# EAGLE design Raspberry_Pi_2_Breakout (EAGLE 8.1.0)
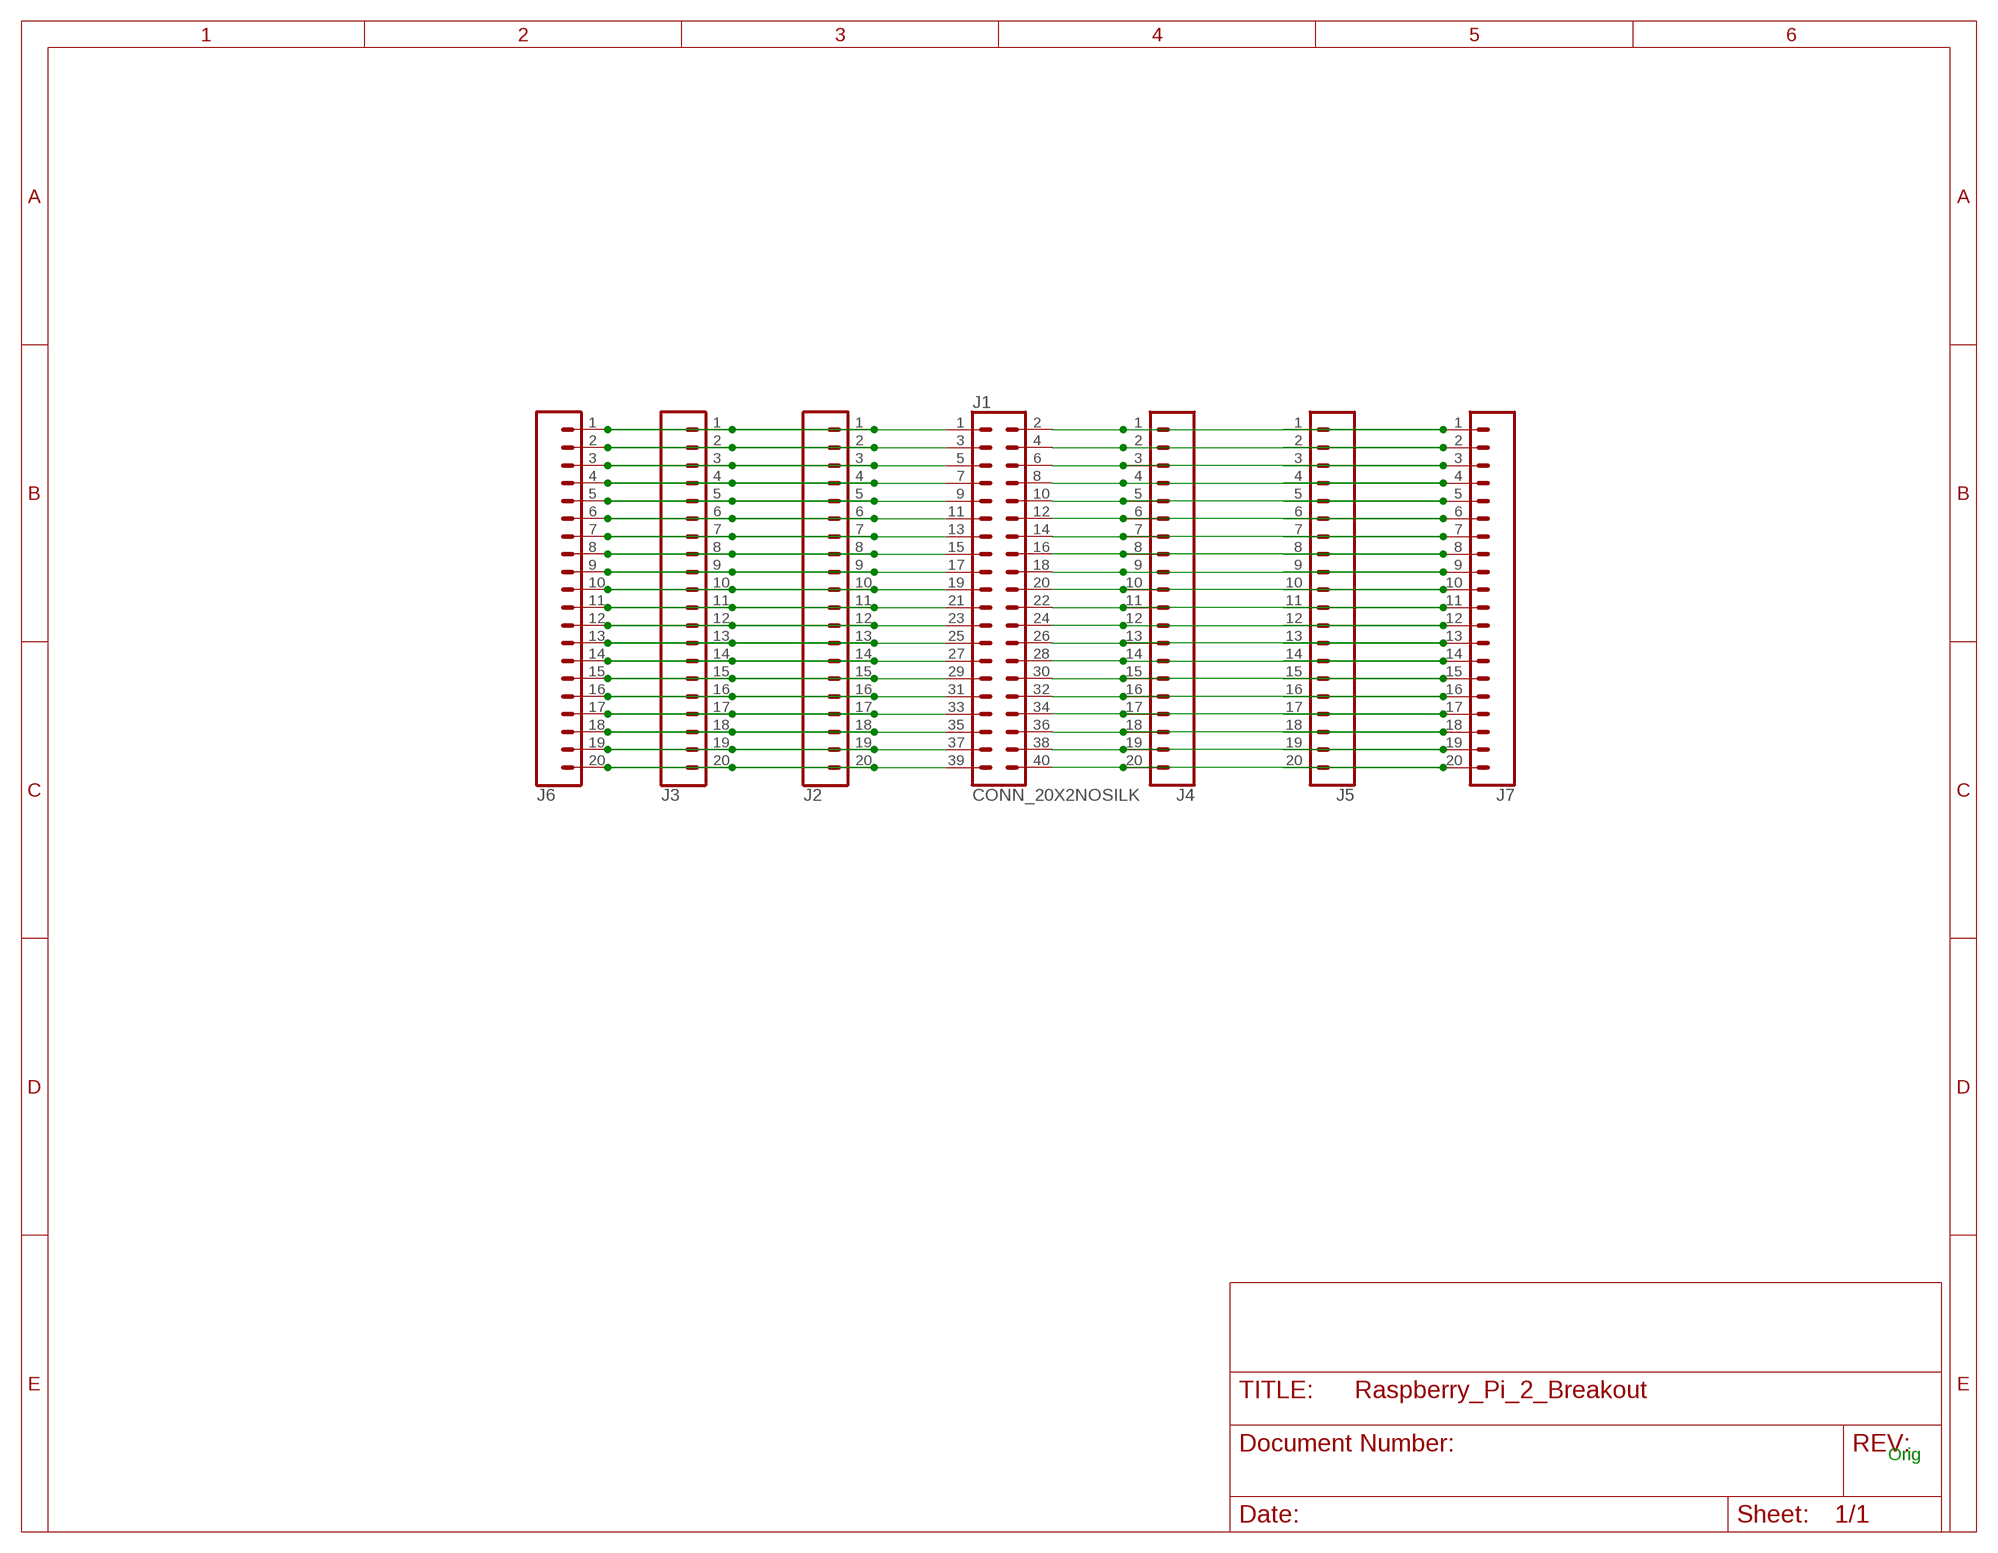
[diagram p0: schematic, sheet 1]

## Parts
J1  CONN_20X2NOSILK  [2X20_NOSILK]
J2  CONN_20NOSILK  [1X20_NOSILK]
J3  CONN_20NOSILK  [1X20_NOSILK]
J4  CONN_20NOSILK  [1X20_NOSILK]
J5  CONN_20NOSILK  [1X20_NOSILK]
J6  CONN_20NOSILK  [1X20_NOSILK]
J7  CONN_20NOSILK  [1X20_NOSILK]

## Nets
N$1: J1.1 J2.1 J3.1 J6.1
N$2: J1.2 J4.1 J5.1 J7.1
N$3: J1.4 J4.2 J5.2 J7.2
N$6: J1.6 J4.3 J5.3 J7.3
N$7: J1.8 J4.4 J5.4 J7.4
N$8: J1.10 J4.5 J5.5 J7.5
N$9: J1.12 J4.6 J5.6 J7.6
N$10: J1.14 J4.7 J5.7 J7.7
N$11: J1.16 J4.8 J5.8 J7.8
N$12: J1.18 J4.9 J5.9 J7.9
N$13: J1.20 J4.10 J5.10 J7.10
N$14: J1.22 J4.11 J5.11 J7.11
N$15: J1.24 J4.12 J5.12 J7.12
N$16: J1.26 J4.13 J5.13 J7.13
N$17: J1.28 J4.14 J5.14 J7.14
N$18: J1.30 J4.15 J5.15 J7.15
N$19: J1.32 J4.16 J5.16 J7.16
N$20: J1.34 J4.17 J5.17 J7.17
N$21: J1.36 J4.18 J5.18 J7.18
N$22: J1.38 J4.19 J5.19 J7.19
N$23: J1.40 J4.20 J5.20 J7.20
N$26: J1.39 J2.20 J3.20 J6.20
N$27: J1.37 J2.19 J3.19 J6.19
N$28: J1.35 J2.18 J3.18 J6.18
N$29: J1.33 J2.17 J3.17 J6.17
N$30: J1.31 J2.16 J3.16 J6.16
N$31: J1.29 J2.15 J3.15 J6.15
N$32: J1.27 J2.14 J3.14 J6.14
N$33: J1.25 J2.13 J3.13 J6.13
N$34: J1.23 J2.12 J3.12 J6.12
N$35: J1.21 J2.11 J3.11 J6.11
N$36: J1.19 J2.10 J3.10 J6.10
N$37: J1.17 J2.9 J3.9 J6.9
N$38: J1.15 J2.8 J3.8 J6.8
N$39: J1.13 J2.7 J3.7 J6.7
N$40: J1.11 J2.6 J3.6 J6.6
N$41: J1.9 J2.5 J3.5 J6.5
N$42: J1.7 J2.4 J3.4 J6.4
N$43: J1.5 J2.3 J3.3 J6.3
N$44: J1.3 J2.2 J3.2 J6.2

## Notes on the sheet
- Orig

## Library data of the parts
J1 = SparkFun-Connectors:CONN_20X2: Multi connection point. Often used as Generic Header-pin footprint for 0.1 inch spaced/style header connections On any of the 0.1 inch spaced packages, you can populate with these: Break Away Headers - Straight <https://www.sparkfun.com/products/116> (PRT-00116) Break Away Male Headers - Right Angle <https://www.sparkfun.com/products/553> (PRT-00553) Female Headers <https://www.sparkfun.com/products/115> (PRT-00115) Break Away Headers - Machine Pin <https://www.sparkfun.com/products/117> (PRT-00117) Break Away Female Headers - Swiss Machine Pin <https://www.sparkfun.com/products/743> (PRT-00743)
J2-J7 = SparkFun-Connectors:CONN_20: Multi connection point. Often used as Generic Header-pin footprint for 0.1 inch spaced/style header connections On any of the 0.1 inch spaced packages, you can populate with these: Break Away Headers - Straight <https://www.sparkfun.com/products/116> (PRT-00116) Break Away Male Headers - Right Angle <https://www.sparkfun.com/products/553> (PRT-00553) Female Headers <https://www.sparkfun.com/products/115> (PRT-00115) Break Away Headers - Machine Pin <https://www.sparkfun.com/products/117> (PRT-00117) Break Away Female Headers - Swiss Machine Pin <https://www.sparkfun.com/products/743> (PRT-00743) For SCREWTERMINALS and SPRING TERMINALS visit here: Screw Terimnals on SparkFun.com <https://www.sparkfun.com/search/results?term=Screw+Terminals> (5mm/3.5mm/2.54mm spacing) This device is also useful as a general connection point to wire up your design to another part of your project. Our various solder wires solder well into these plated through hole pads. Hook-Up Wire - Assortment (Stranded, 22 AWG) <https://www.sparkfun.com/products/11375> (PRT-11375) Hook-Up Wire - Assortment (Solid Core, 22 AWG) <https://www.sparkfun.com/products/11367> (PRT-11367) View the entire wire category on our website here <https://www.sparkfun.com/categories/141> Special notes: Molex polarized connector foot print use with SKU : PRT-08231 with associated crimp pins and housings. 1MM SMD Version SKU: PRT-10208 NOTES ON THE VARIANTS LOCK and LOCK_LONGPADS... This footprint was designed to help hold the alignment of a through-hole component (i.e. 6-pin header) while soldering it into place. You may notice that each hole has been shifted either up or down by 0.005 of an inch from it's more standard position (which is a perfectly straight line). This slight alteration caused the pins (the squares in the middle) to touch the edges of the holes. Because they are alternating, it causes a "brace" to hold the component in place. 0.005 has proven to be the perfect amount of "off-center" position when using our standard breakaway headers. Although looks a little odd when you look at the bare footprint, once you have a header in there, the alteration is very hard to notice. Also,if you push a header all the way into place, it is covered up entirely on the bottom side. Note about LOCK SPECIAL package: This is just like the LOCK variant in that the holes are staggared by 5 mil, but except for the last two holes. They are not altered from the "standard" footprint layout. This is used for a special purpose on the layout of our Graphic LCD Backpack. Make sure you want to use this device before selecting it for you project!

## Board
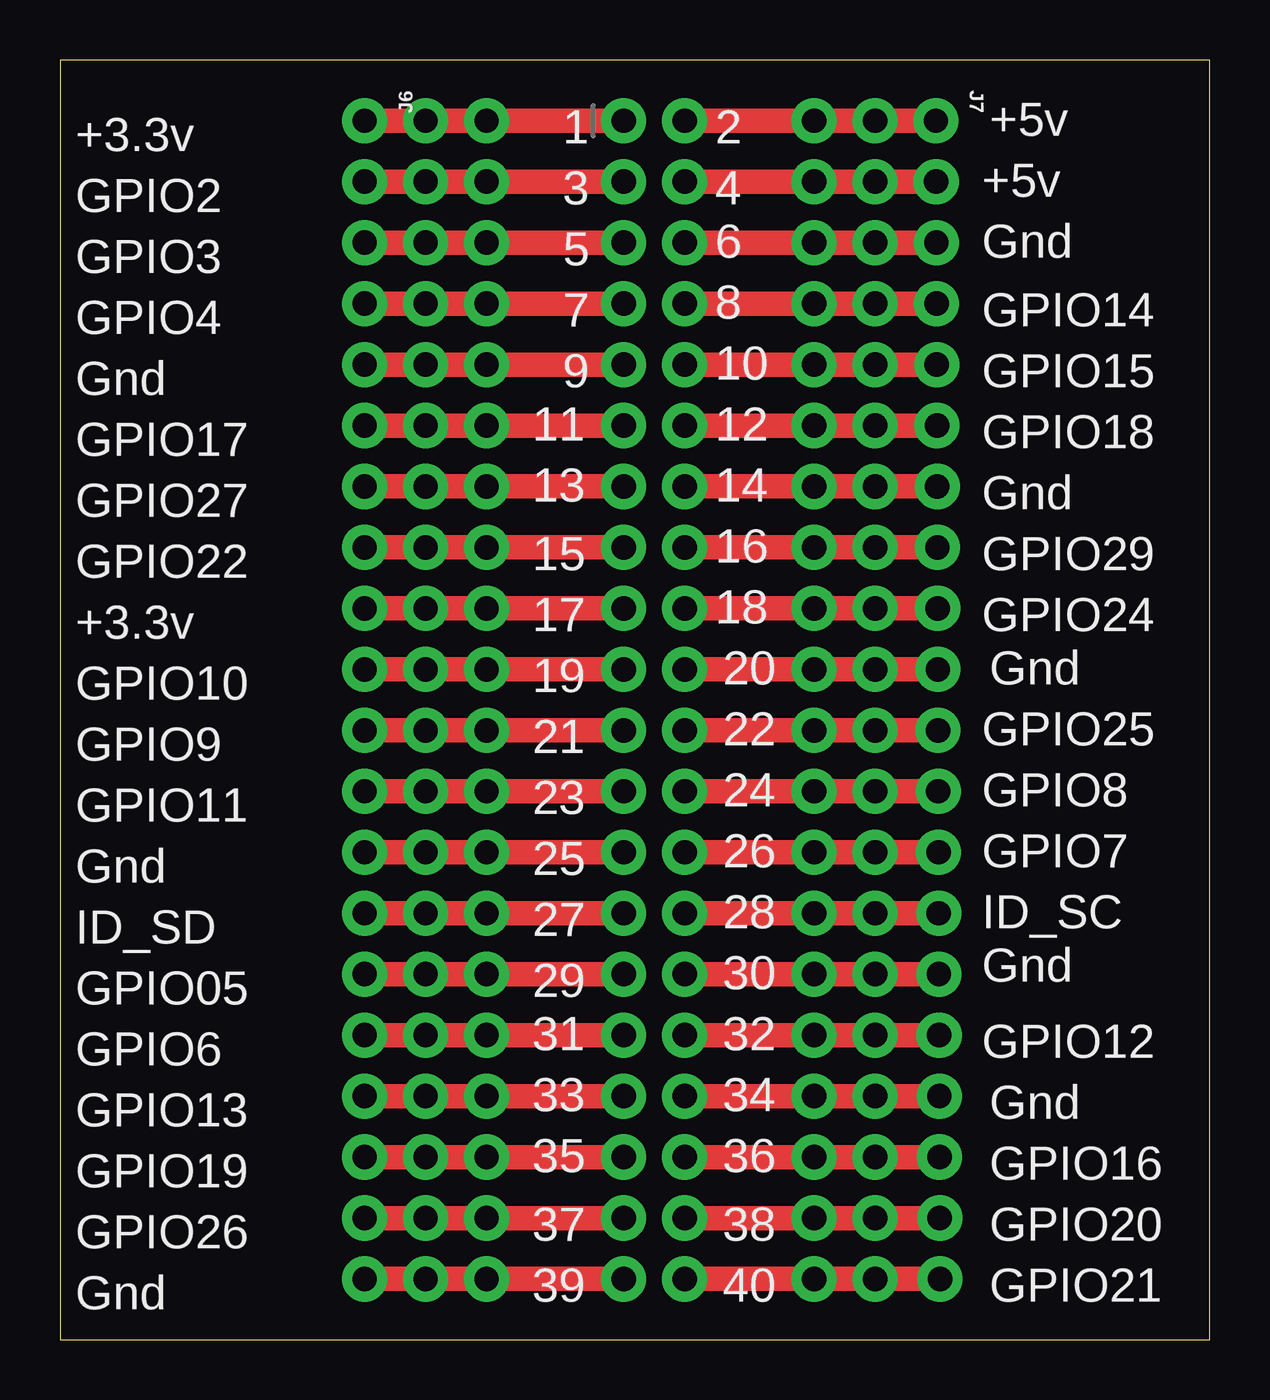
[diagram p1: board, top side]

Size 47.93 x 53.33 mm. Coordinates in mm from the lower left corner, seen from the top.
Outline: 0,0 47.93,0 47.93,53.33 0,53.33 0,0
Copper layers (1*16): Top 0.035mm / dielectric 1.5mm / Bottom 0.035mm
Design rules "default": minimum track width 10mil, minimum drill 24mil, track to track 8mil, track to pad 8mil, pad to pad 8mil, via to via 8mil, smd to smd 8mil, copper to edge 40mil, drill to drill 8mil, minimum pad ring 10mil, minimum via ring 8mil, stop-mask expansion 4mil, vias tented up to drill 0mil, thermal gap 10mil

### Footprints (pad centres in the part's own frame; a part is rotated, then mirrored left to right if it is on the bottom)
2X20_NOSILK = drill 1.016 pad 1.88: 1 0,0; 2 0,2.54; 3 2.54,0; 4 2.54,2.54; 5 5.08,0; 6 5.08,2.54; 7 7.62,0; 8 7.62,2.54; 9 10.16,0; 10 10.16,2.54; 11 12.7,0; 12 12.7,2.54; 13 15.24,0; 14 15.24,2.54; 15 17.78,0; 16 17.78,2.54; 17 20.32,0; 18 20.32,2.54; 19 22.86,0; 20 22.86,2.54; 21 25.4,0; 22 25.4,2.54; 23 27.94,0; 24 27.94,2.54; 25 30.48,0; 26 30.48,2.54; 27 33.02,0; 28 33.02,2.54; 29 35.56,0; 30 35.56,2.54; 31 38.1,0; 32 38.1,2.54; 33 40.64,0; 34 40.64,2.54; 35 43.18,0; 36 43.18,2.54; 37 45.72,0; 38 45.72,2.54; 39 48.26,0; 40 48.26,2.54
1X20_NOSILK = drill 1.016 pad 1.88: 1 0,0; 2 2.54,0; 3 5.08,0; 4 7.62,0; 5 10.16,0; 6 12.7,0; 7 15.24,0; 8 17.78,0; 9 20.32,0; 10 22.86,0; 11 25.4,0; 12 27.94,0; 13 30.48,0; 14 33.02,0; 15 35.56,0; 16 38.1,0; 17 40.64,0; 18 43.18,0; 19 45.72,0; 20 48.26,0

### Placement (x,y rotation side)
J1  23.5,50.8 270 top
J2  17.78,50.8 270 top
J3  15.24,50.8 270 top
J4  31.43,50.8 270 top
J5  33.97,50.8 270 top
J6  12.7,50.8 270 top
J7  36.51,50.8 270.2 top

### Tracks (layer width: path | path; a pad name or v marks a point on that pad's centre or on a via)
N$1
  Top 1.016: J6.1 J3.1 J2.1 J1.1
N$2
  Top 1.016: J7.1 J5.1 J4.1 J1.2
N$3
  Top 1.016: J7.2 36.2,48.26 J5.2 J4.2 J1.4
N$6
  Top 1.016: J7.3 36.2,45.72 J5.3 J4.3 J1.6
N$7
  Top 1.016: J7.4 36.2,43.18 J5.4 J4.4 J1.8
N$8
  Top 1.016: J7.5 36.2,40.64 J5.5 J4.5 J1.10
N$9
  Top 1.016: J7.6 36.2,38.1 J5.6 J4.6 J1.12
N$10
  Top 1.016: J7.7 36.2,35.56 J5.7 J4.7 J1.14
N$11
  Top 1.016: J7.8 36.2,33.02 J5.8 J4.8 J1.16
N$12
  Top 1.016: J7.9 36.2,30.48 J5.9 J4.9 J1.18
N$13
  Top 1.016: J7.10 36.2,27.94 J5.10 J4.10 J1.20
N$14
  Top 1.016: J7.11 36.2,25.4 J5.11 J4.11 J1.22
N$15
  Top 1.016: J7.12 36.2,22.86 J5.12 J4.12 J1.24
N$16
  Top 1.016: J7.13 36.2,20.32 J5.13 J4.13 J1.26
N$17
  Top 1.016: J7.14 36.2,17.78 J5.14 J4.14 J1.28
N$18
  Top 1.016: J7.15 36.2,15.24 J5.15 J4.15 J1.30
N$19
  Top 1.016: J7.16 36.2,12.7 J5.16 J4.16 J1.32
N$20
  Top 1.016: J7.17 36.2,10.16 J5.17 J4.17 J1.34
N$21
  Top 1.016: J7.18 36.2,7.62 J5.18 J4.18 J1.36
N$22
  Top 1.016: J7.19 36.2,5.08 J5.19 J4.19 J1.38
N$23
  Top 1.016: J7.20 36.2,2.54 J5.20 J4.20 J1.40
N$26
  Top 1.016: J6.20 J3.20 J2.20 J1.39
N$27
  Top 1.016: J6.19 J3.19 J2.19 J1.37
N$28
  Top 1.016: J6.18 J3.18 J2.18 J1.35
N$29
  Top 1.016: J6.17 J3.17 J2.17 J1.33
N$30
  Top 1.016: J6.16 J3.16 J2.16 J1.31
N$31
  Top 1.016: J6.15 J3.15 J2.15 J1.29
N$32
  Top 1.016: J6.14 J3.14 J2.14 J1.27
N$33
  Top 1.016: J6.13 J3.13 J2.13 J1.25
N$34
  Top 1.016: J6.12 J3.12 J2.12 J1.23
N$35
  Top 1.016: J6.11 J3.11 J2.11 J1.21
N$36
  Top 1.016: J6.10 J3.10 J2.10 J1.19
N$37
  Top 1.016: J6.9 J3.9 J2.9 J1.17
N$38
  Top 1.016: J6.8 J3.8 J2.8 J1.15
N$39
  Top 1.016: J6.7 J3.7 J2.7 J1.13
N$40
  Top 1.016: J6.6 J3.6 J2.6 J1.11
N$41
  Top 1.016: J6.5 J3.5 J2.5 J1.9
N$42
  Top 1.016: J6.4 J3.4 J2.4 J1.7
N$43
  Top 1.016: J6.3 J3.3 J2.3 J1.5
N$44
  Top 1.016: J6.2 J3.2 J2.2 J1.3

### Text on the board
_tsilk: +3.3v | 1 | 2 | +5v | +5v | GPIO2 | 3 | 4 | 5 | 6 | Gnd | GPIO3 | 8 | GPIO4 | 7 | GPIO14 | 9 | 10 | GPIO15 | Gnd | GPIO17 | 11 | 12 | GPIO18 | 13 | 14 | Gnd | GPIO27 | GPIO22 | 15 | 16 | GPIO29 | 17 | 18 | GPIO24 | +3.3v | GPIO10 | 19 | 20 | Gnd | 22 | GPIO25 | GPIO9 | 21 | GPIO11 | 23 | 24 | GPIO8 | 26 | GPIO7 | Gnd | 25 | ID_SD | 27 | 28 | ID_SC | 30 | Gnd | GPIO05 | 29 | 31 | 32 | GPIO12 | GPIO6 | 33 | 34 | GPIO13 | Gnd | 35 | 36 | GPIO16 | GPIO19 | GPIO26 | 37 | 38 | GPIO20 | 39 | 40 | GPIO21 | Gnd
_bsilk: 20170404 | AGA Associates | Raspberry Pi2 Breakout | Rev: Orig